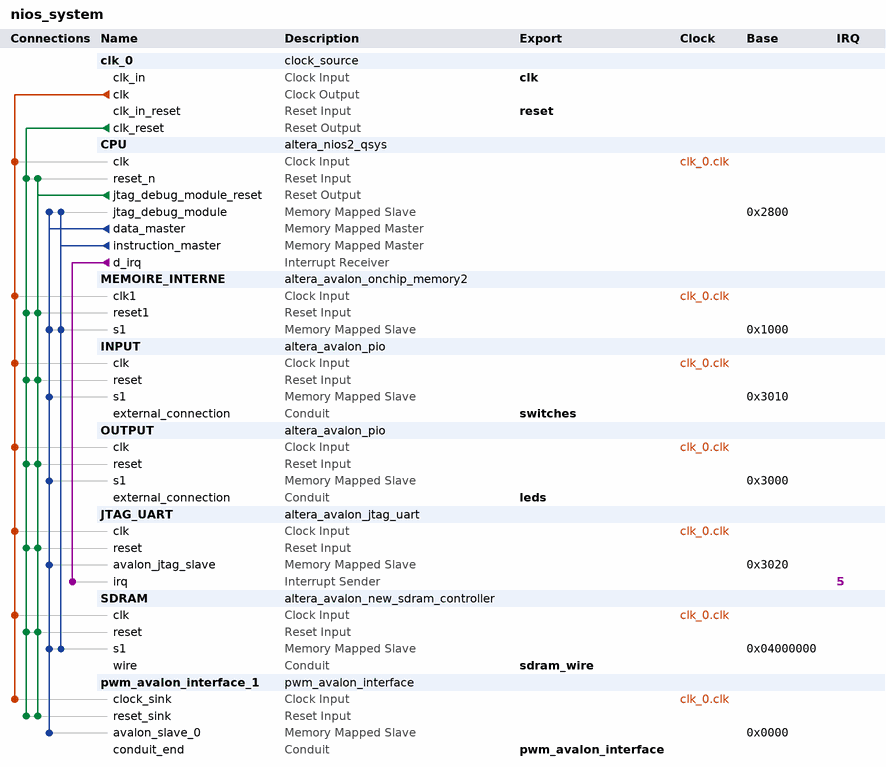
[diagram p0: system contents]
# Platform Designer (Qsys) system nios_system, Cyclone IV E EP4CE22F17C6
# Parameters at their usual value, and those the tool derives, are not listed.
package require -exact qsys 13.0.1.99.2
create_system nios_system
set_project_property DEVICE_FAMILY {Cyclone IV E}
set_project_property DEVICE EP4CE22F17C6

add_instance clk_0 clock_source 13.0
set_instance_parameter_value clk_0 clockFrequency 50000000

add_instance CPU altera_nios2_qsys 13.0
set_instance_parameter_value CPU resetSlave SDRAM.s1
set_instance_parameter_value CPU mmu_TLBMissExcSlave None
set_instance_parameter_value CPU exceptionSlave SDRAM.s1
set_instance_parameter_value CPU breakSlave CPU.jtag_debug_module
set_instance_parameter_value CPU impl Tiny
set_instance_parameter_value CPU icache_size 4096

add_instance MEMOIRE_INTERNE altera_avalon_onchip_memory2 13.0.1.99.2
set_instance_parameter_value MEMOIRE_INTERNE dataWidth 32
set_instance_parameter_value MEMOIRE_INTERNE dualPort false
set_instance_parameter_value MEMOIRE_INTERNE initMemContent true
set_instance_parameter_value MEMOIRE_INTERNE initializationFileName onchip_mem.hex
set_instance_parameter_value MEMOIRE_INTERNE memorySize 4096

add_instance INPUT altera_avalon_pio 13.0.1.99.2
set_instance_parameter_value INPUT direction Input
set_instance_parameter_value INPUT width 8

add_instance OUTPUT altera_avalon_pio 13.0.1.99.2
set_instance_parameter_value OUTPUT direction Output
set_instance_parameter_value OUTPUT width 8

add_instance JTAG_UART altera_avalon_jtag_uart 13.0.1.99.2
set_instance_parameter_value JTAG_UART simInteractiveOptions NO_INTERACTIVE_WINDOWS

add_instance SDRAM altera_avalon_new_sdram_controller 13.0.1.99.2
set_instance_parameter_value SDRAM TAC 5.5
set_instance_parameter_value SDRAM TRCD 20.0
set_instance_parameter_value SDRAM TRP 20.0
set_instance_parameter_value SDRAM casLatency 3
set_instance_parameter_value SDRAM columnWidth 9
set_instance_parameter_value SDRAM dataWidth 16
set_instance_parameter_value SDRAM generateSimulationModel false
set_instance_parameter_value SDRAM model single_Micron_MT48LC4M32B2_7_chip
set_instance_parameter_value SDRAM numberOfBanks 4
set_instance_parameter_value SDRAM numberOfChipSelects 1
set_instance_parameter_value SDRAM powerUpDelay 100.0
set_instance_parameter_value SDRAM refreshPeriod 15.625
set_instance_parameter_value SDRAM rowWidth 13

add_instance pwm_avalon_interface_1 pwm_avalon_interface 1.0

# connections
add_connection clk_0.clk CPU.clk clock
add_connection clk_0.clk INPUT.clk clock
add_connection clk_0.clk JTAG_UART.clk clock
add_connection clk_0.clk MEMOIRE_INTERNE.clk1 clock
add_connection clk_0.clk OUTPUT.clk clock
add_connection clk_0.clk pwm_avalon_interface_1.clock_sink clock
add_connection clk_0.clk SDRAM.clk clock
add_connection clk_0.clk_reset CPU.reset_n reset
add_connection clk_0.clk_reset INPUT.reset reset
add_connection clk_0.clk_reset JTAG_UART.reset reset
add_connection clk_0.clk_reset MEMOIRE_INTERNE.reset1 reset
add_connection clk_0.clk_reset OUTPUT.reset reset
add_connection clk_0.clk_reset pwm_avalon_interface_1.reset_sink reset
add_connection clk_0.clk_reset SDRAM.reset reset
add_connection CPU.jtag_debug_module_reset CPU.reset_n reset
add_connection CPU.jtag_debug_module_reset INPUT.reset reset
add_connection CPU.jtag_debug_module_reset JTAG_UART.reset reset
add_connection CPU.jtag_debug_module_reset MEMOIRE_INTERNE.reset1 reset
add_connection CPU.jtag_debug_module_reset OUTPUT.reset reset
add_connection CPU.jtag_debug_module_reset pwm_avalon_interface_1.reset_sink reset
add_connection CPU.jtag_debug_module_reset SDRAM.reset reset
add_connection CPU.data_master CPU.jtag_debug_module avalon
set_connection_parameter_value CPU.data_master/CPU.jtag_debug_module baseAddress 0x2800
add_connection CPU.data_master INPUT.s1 avalon
set_connection_parameter_value CPU.data_master/INPUT.s1 baseAddress 0x3010
add_connection CPU.data_master JTAG_UART.avalon_jtag_slave avalon
set_connection_parameter_value CPU.data_master/JTAG_UART.avalon_jtag_slave baseAddress 0x3020
add_connection CPU.data_master MEMOIRE_INTERNE.s1 avalon
set_connection_parameter_value CPU.data_master/MEMOIRE_INTERNE.s1 baseAddress 0x1000
add_connection CPU.data_master OUTPUT.s1 avalon
set_connection_parameter_value CPU.data_master/OUTPUT.s1 baseAddress 0x3000
add_connection CPU.data_master pwm_avalon_interface_1.avalon_slave_0 avalon
set_connection_parameter_value CPU.data_master/pwm_avalon_interface_1.avalon_slave_0 baseAddress 0x0000
add_connection CPU.data_master SDRAM.s1 avalon
set_connection_parameter_value CPU.data_master/SDRAM.s1 baseAddress 0x04000000
add_connection CPU.instruction_master CPU.jtag_debug_module avalon
set_connection_parameter_value CPU.instruction_master/CPU.jtag_debug_module baseAddress 0x2800
add_connection CPU.instruction_master MEMOIRE_INTERNE.s1 avalon
set_connection_parameter_value CPU.instruction_master/MEMOIRE_INTERNE.s1 baseAddress 0x1000
add_connection CPU.instruction_master SDRAM.s1 avalon
set_connection_parameter_value CPU.instruction_master/SDRAM.s1 baseAddress 0x04000000
add_connection CPU.d_irq JTAG_UART.irq interrupt
set_connection_parameter_value CPU.d_irq/JTAG_UART.irq irqNumber 5

# exported interfaces
add_interface clk clock sink
set_interface_property clk EXPORT_OF clk_0.clk_in
add_interface reset reset sink
set_interface_property reset EXPORT_OF clk_0.clk_in_reset
add_interface switches conduit end
set_interface_property switches EXPORT_OF INPUT.external_connection
add_interface leds conduit end
set_interface_property leds EXPORT_OF OUTPUT.external_connection
add_interface sdram_wire conduit end
set_interface_property sdram_wire EXPORT_OF SDRAM.wire
add_interface pwm_avalon_interface conduit end
set_interface_property pwm_avalon_interface EXPORT_OF pwm_avalon_interface_1.conduit_end

set_interconnect_requirement {$system} qsys_mm.clockCrossingAdapter HANDSHAKE
set_interconnect_requirement {$system} qsys_mm.maxAdditionalLatency 1

save_system nios_system.qsys
